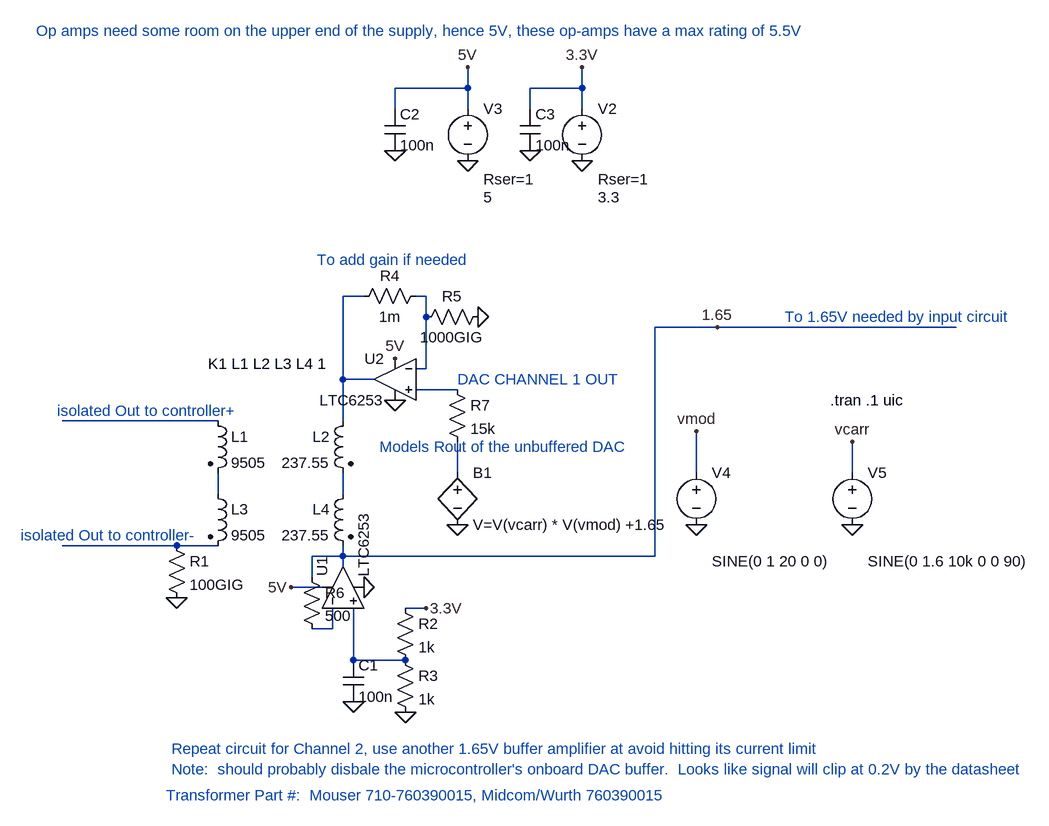
[diagram p0: schematic DAC output circuit.asc]
DAC output circuit.asc, the LTspice schematic file:
Version 4
SHEET 1 1984 680
WIRE 304 -512 304 -544
WIRE 304 -512 192 -512
WIRE 480 -512 480 -544
WIRE 480 -512 400 -512
WIRE 192 -480 192 -512
WIRE 304 -480 304 -512
WIRE 400 -480 400 -512
WIRE 480 -480 480 -512
WIRE 144 -192 112 -192
WIRE 240 -192 224 -192
WIRE 240 -160 240 -192
WIRE 688 -144 592 -144
WIRE 1056 -144 688 -144
WIRE 240 -80 240 -160
WIRE 240 -80 224 -80
WIRE 112 -64 112 -192
WIRE 160 -64 112 -64
WIRE 288 -48 224 -48
WIRE -80 0 -320 0
WIRE 112 0 112 -64
WIRE 288 80 288 32
WIRE 656 80 656 16
WIRE 896 80 896 32
WIRE -80 112 -80 80
WIRE 112 112 112 80
WIRE -144 192 -320 192
WIRE -80 192 -144 192
WIRE 112 208 112 192
WIRE 112 208 64 208
WIRE 592 208 592 -144
WIRE 592 208 112 208
WIRE 112 224 112 208
WIRE 64 240 64 208
WIRE 80 256 32 256
WIRE 240 288 208 288
WIRE 96 320 96 288
WIRE 96 320 64 320
WIRE 128 368 128 288
WIRE 208 368 128 368
FLAG 288 160 0
FLAG -144 272 0
FLAG 144 256 0
FLAG 208 448 0
FLAG 32 256 5V
FLAG 192 -96 5V
FLAG 192 -32 0
FLAG 128 432 0
FLAG 240 288 3.3V
FLAG 304 -400 0
FLAG 480 -400 0
FLAG 304 -544 5V
FLAG 480 -544 3.3V
FLAG 656 160 0
FLAG 656 16 vmod
FLAG 896 160 0
FLAG 896 32 vcarr
FLAG 688 -144 1.65
FLAG 320 -160 0
FLAG 192 -416 0
FLAG 400 -416 0
SYMBOL ind2 -96 -16 R0
SYMATTR InstName L1
SYMATTR Value 9505
SYMATTR Type ind
SYMATTR SpiceLine Rser=0.57
SYMBOL ind2 128 -16 M0
SYMATTR InstName L2
SYMATTR Value 237.55
SYMATTR Type ind
SYMATTR SpiceLine Rser=0.35
SYMBOL ind2 -96 96 R0
SYMATTR InstName L3
SYMATTR Value 9505
SYMATTR Type ind
SYMATTR SpiceLine Rser=0.57
SYMBOL ind2 128 96 M0
SYMATTR InstName L4
SYMATTR Value 237.55
SYMATTR Type ind
SYMATTR SpiceLine Rser=0.35
SYMBOL res -160 176 R0
SYMATTR InstName R1
SYMATTR Value 100GIG
SYMBOL Opamps\\LTC6253 112 256 R270
SYMATTR InstName U1
SYMBOL res 192 272 R0
SYMATTR InstName R2
SYMATTR Value 1k
SYMBOL res 192 352 R0
SYMATTR InstName R3
SYMATTR Value 1k
SYMBOL Opamps\\LTC6253 192 -64 M0
SYMATTR InstName U2
SYMBOL cap 112 368 R0
SYMATTR InstName C1
SYMATTR Value 100n
SYMBOL voltage 480 -496 R0
WINDOW 3 24 152 Left 2
WINDOW 123 0 0 Left 2
WINDOW 39 24 124 Left 2
SYMATTR InstName V2
SYMATTR Value 3.3
SYMATTR SpiceLine Rser=1
SYMBOL voltage 304 -496 R0
WINDOW 3 24 152 Left 2
WINDOW 123 0 0 Left 2
WINDOW 39 24 124 Left 2
SYMATTR InstName V3
SYMATTR Value 5
SYMATTR SpiceLine Rser=1
SYMBOL voltage 656 64 R0
WINDOW 3 24 152 Left 2
WINDOW 123 0 0 Left 2
WINDOW 39 24 180 Left 2
SYMATTR InstName V4
SYMATTR Value SINE(0 1 20 0 0)
SYMBOL voltage 896 64 R0
WINDOW 3 24 152 Left 2
WINDOW 123 0 0 Left 2
WINDOW 39 24 180 Left 2
SYMATTR InstName V5
SYMATTR Value SINE(0 1.6 10k 0 0 90)
SYMBOL bv 288 64 R0
SYMATTR InstName B1
SYMATTR Value V=V(vcarr) * V(vmod) +1.65
SYMBOL res 240 -208 R90
WINDOW 0 0 56 VBottom 2
WINDOW 3 32 56 VTop 2
SYMATTR InstName R4
SYMATTR Value 1m
SYMBOL res 336 -176 R90
WINDOW 0 0 56 VBottom 2
WINDOW 3 32 56 VTop 2
SYMATTR InstName R5
SYMATTR Value 1000GIG
SYMBOL res 48 224 R0
SYMATTR InstName R6
SYMATTR Value 500
SYMBOL res 272 -64 R0
SYMATTR InstName R7
SYMATTR Value 15k
SYMBOL cap 176 -480 R0
SYMATTR InstName C2
SYMATTR Value 100n
SYMBOL cap 384 -480 R0
SYMATTR InstName C3
SYMATTR Value 100n
TEXT 862 -32 Left 2 !.tran .1 uic
TEXT -96 -88 Left 2 !K1 L1 L2 L3 L4 1
TEXT -328 -16 Left 2 ;isolated Out to controller+
TEXT -384 176 Left 2 ;isolated Out to controller-
TEXT 288 -64 Left 2 ;DAC CHANNEL 1 OUT
TEXT 792 -160 Left 2 ;To 1.65V needed by input circuit
TEXT -152 504 Left 2 ;Repeat circuit for Channel 2, use another 1.65V buffer amplifier at avoid hitting its current limit
TEXT 72 -248 Left 2 ;To add gain if needed
TEXT -360 -600 Left 2 ;Op amps need some room on the upper end of the supply, hence 5V, these op-amps have a max rating of 5.5V
TEXT 168 40 Left 2 ;Models Rout of the unbuffered DAC
TEXT -152 536 Left 2 ;Note:  should probably disbale the microcontroller's onboard DAC buffer.  Looks like signal will clip at 0.2V by the datasheet
TEXT -160 576 Left 2 ;Transformer Part #:  Mouser 710-760390015, Midcom/Wurth 760390015

The netlist it stands for:
* DAC output circuit.asc
L1 N004 N006 9505 Rser=0.57
L2 N001 N007 237.55 Rser=0.35
L3 N006 N008 9505 Rser=0.57
L4 N007 1.65 237.55 Rser=0.35
R1 N008 0 100GIG
* U1: LTC6253 (symbol Opamps\LTC6253 not available, pins judged from their places): In+=N010 In-=N009 V+=5V V-=0 OUT=1.65
R2 3.3V N010 1k
R3 N010 0 1k
* U2: LTC6253 (symbol Opamps\LTC6253 not available, pins judged from their places): In+=N003 In-=N002 V+=5V V-=0 OUT=N001
C1 N010 0 100n
V2 3.3V 0 3.3 Rser=1
V3 5V 0 5 Rser=1
V4 vmod 0 SINE(0 1 20 0 0)
V5 vcarr 0 SINE(0 1.6 10k 0 0 90)
B1 N005 0 V=V(vcarr) * V(vmod) +1.65
R4 N002 N001 1m
R5 0 N002 1000GIG
R6 1.65 N009 500
R7 N003 N005 15k
C2 5V 0 100n
C3 3.3V 0 100n
.tran .1 uic
K1 L1 L2 L3 L4 1
* isolated Out to controller+
* isolated Out to controller-
* DAC CHANNEL 1 OUT
* To 1.65V needed by input circuit
* Repeat circuit for Channel 2, use another 1.65V buffer amplifier at avoid hitting its current limit
* To add gain if needed
* Op amps need some room on the upper end of the supply, hence 5V, these op-amps have a max rating of 5.5V
* Models Rout of the unbuffered DAC
* Note:  should probably disbale the microcontroller's onboard DAC buffer.  Looks like signal will clip at 0.2V by the datasheet
* Transformer Part #:  Mouser 710-760390015, Midcom/Wurth 760390015
.backanno
.end